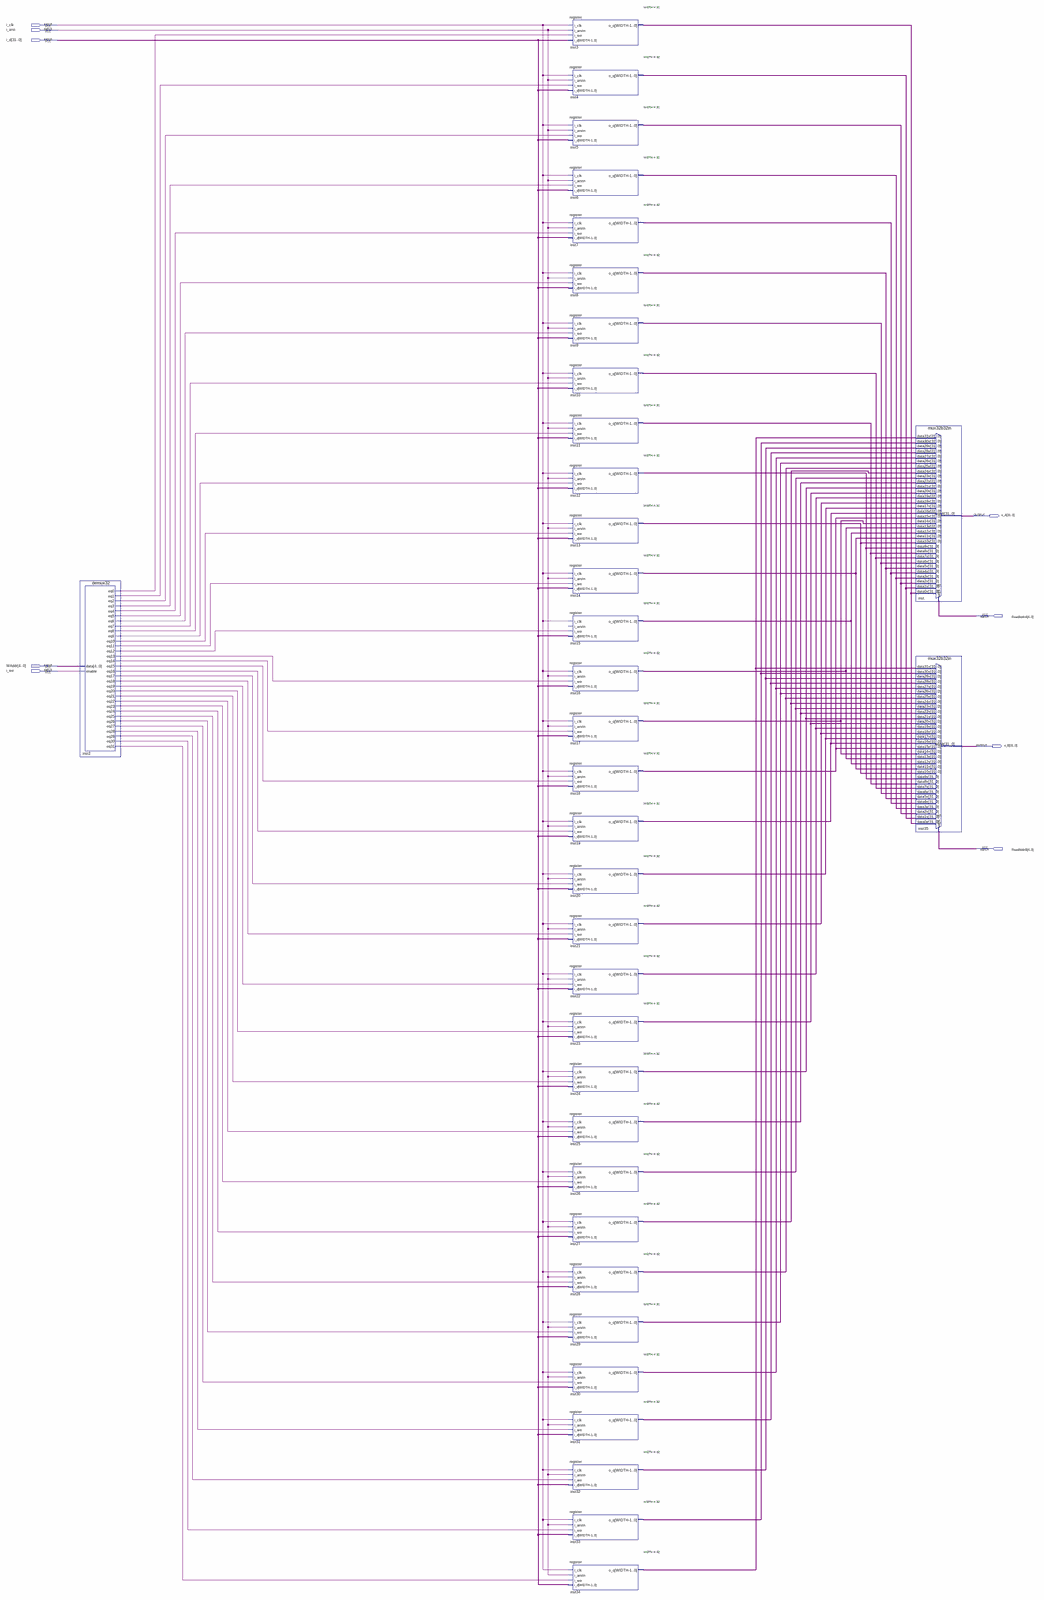
[diagram p0: schematic sheet, whole]
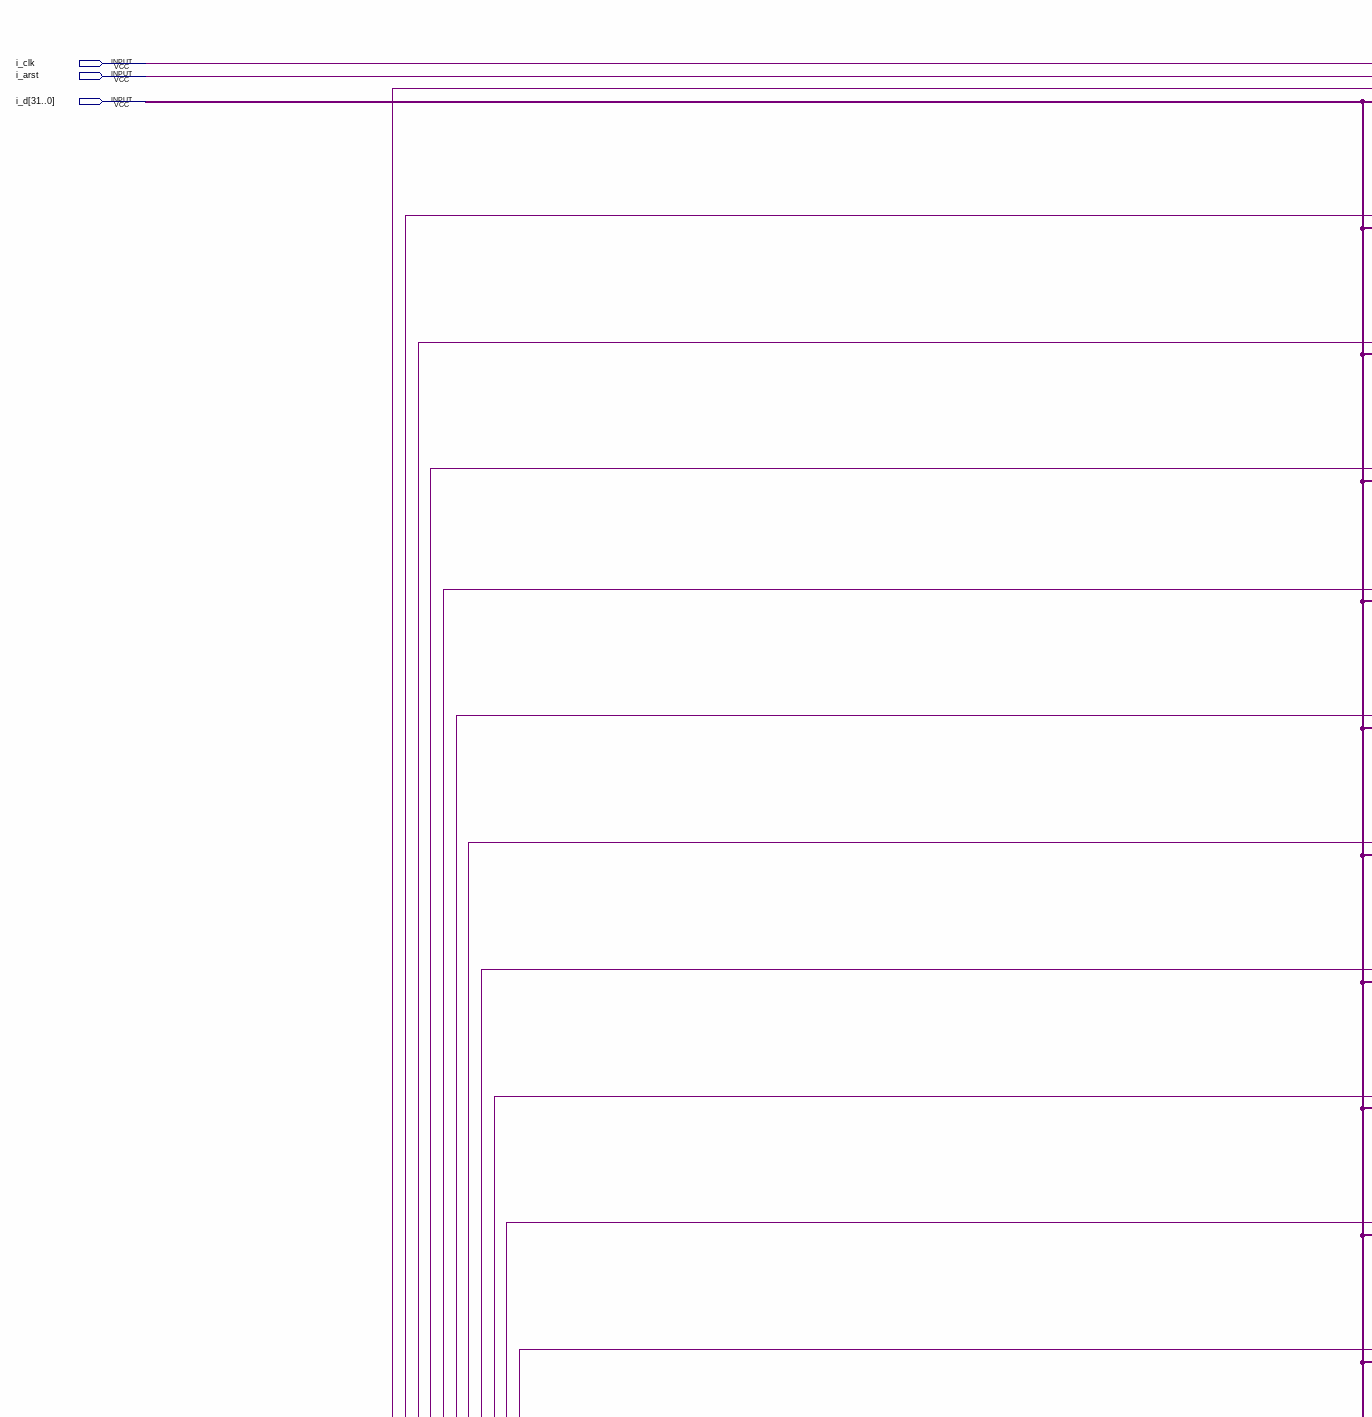
[diagram p1: schematic sheet, upper left part]
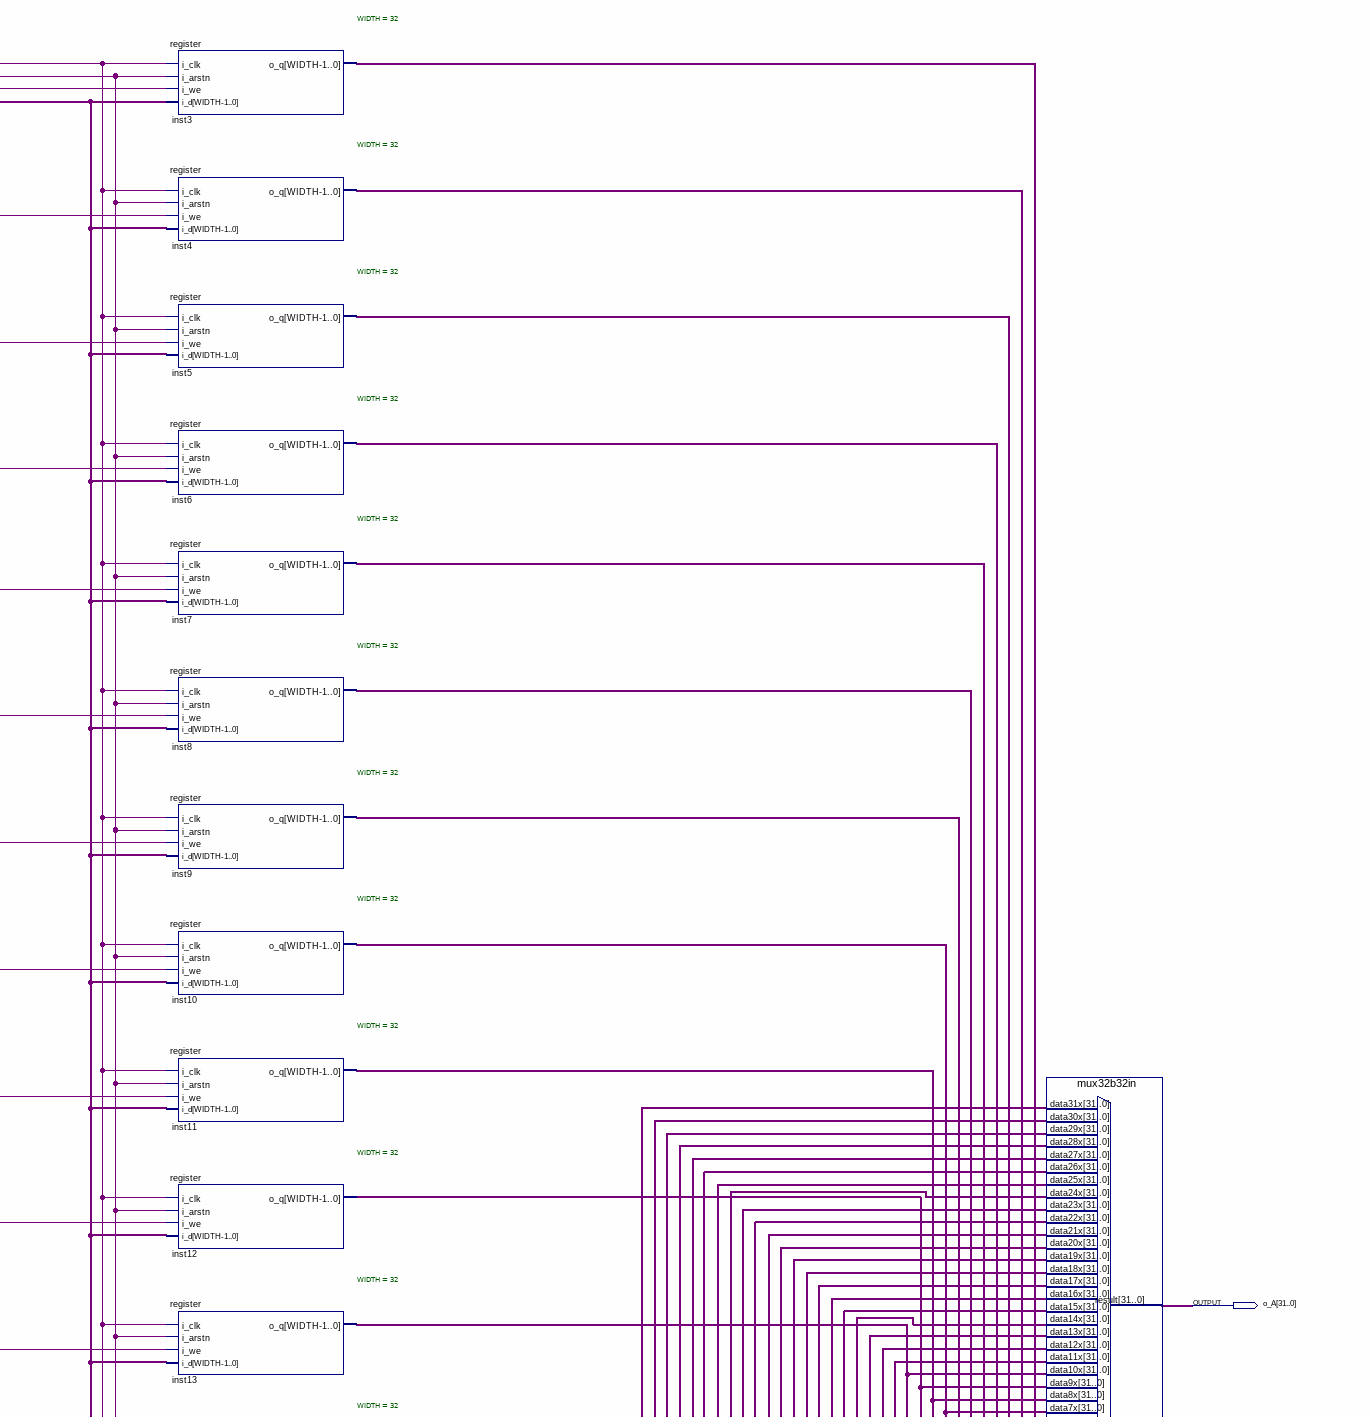
[diagram p2: schematic sheet, upper right part]
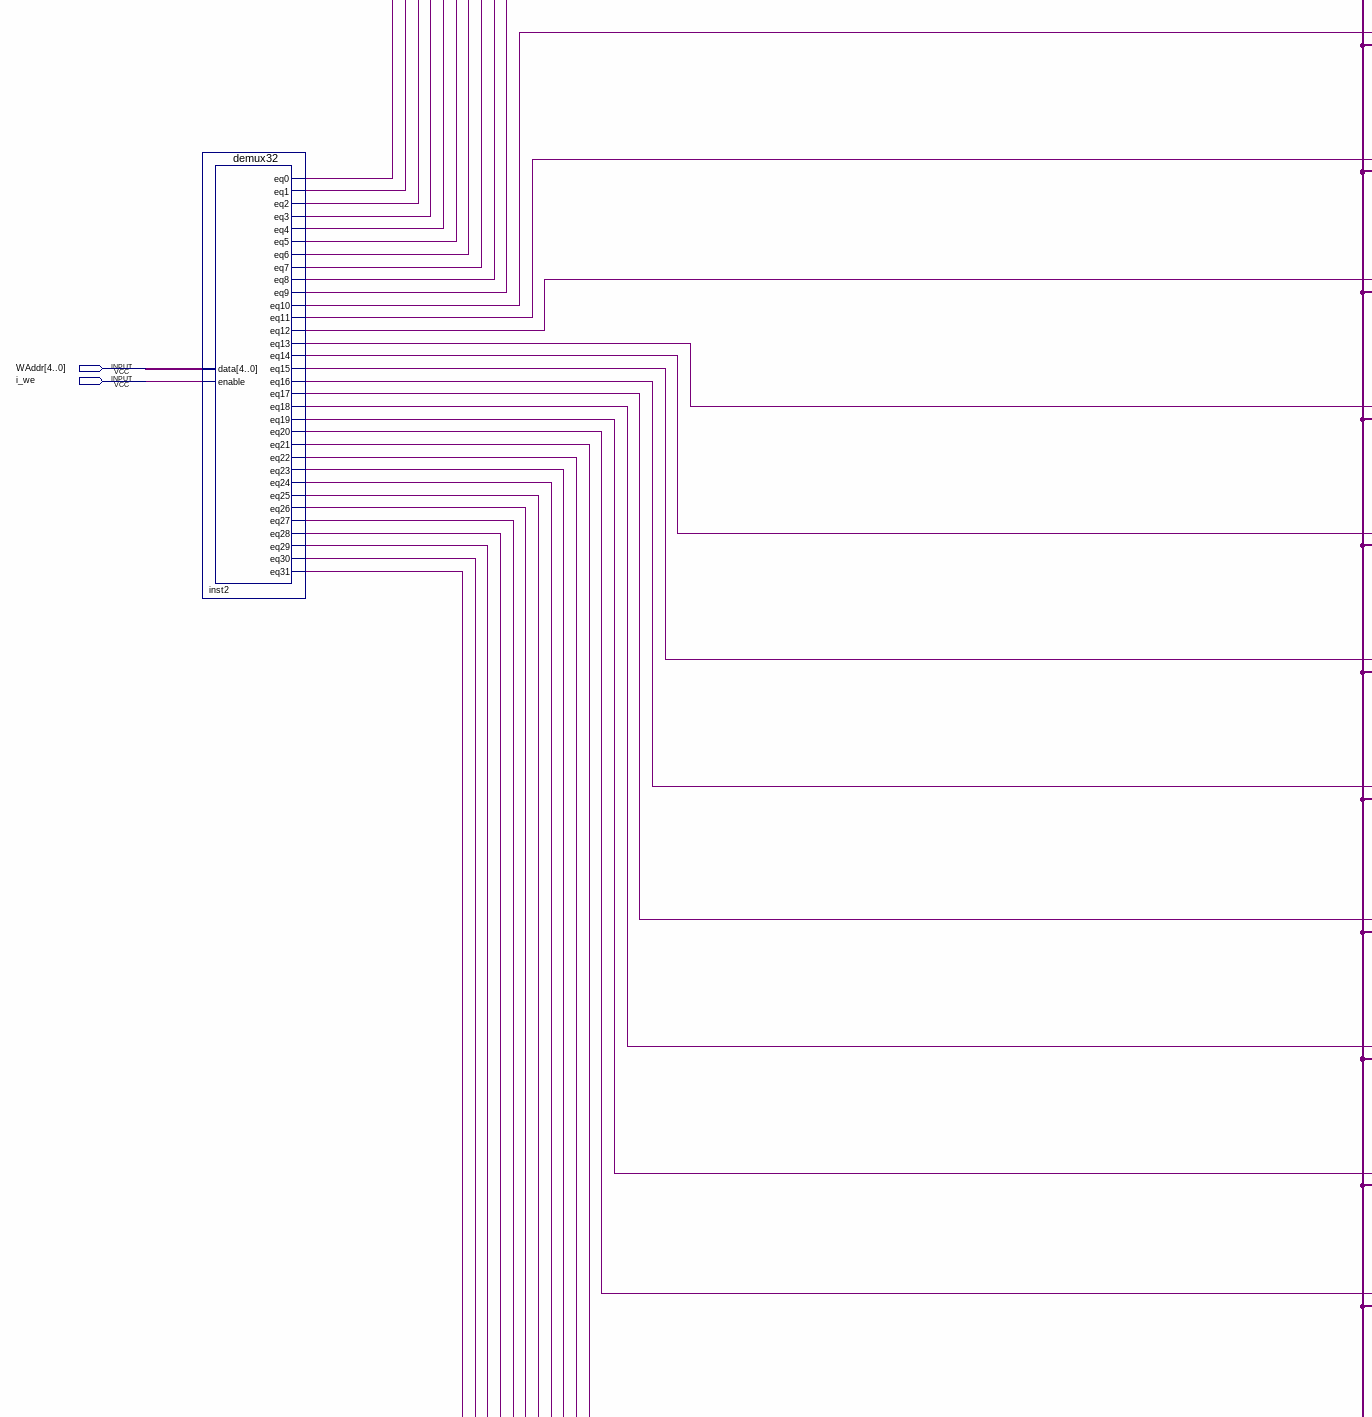
[diagram p3: schematic sheet, middle left part]
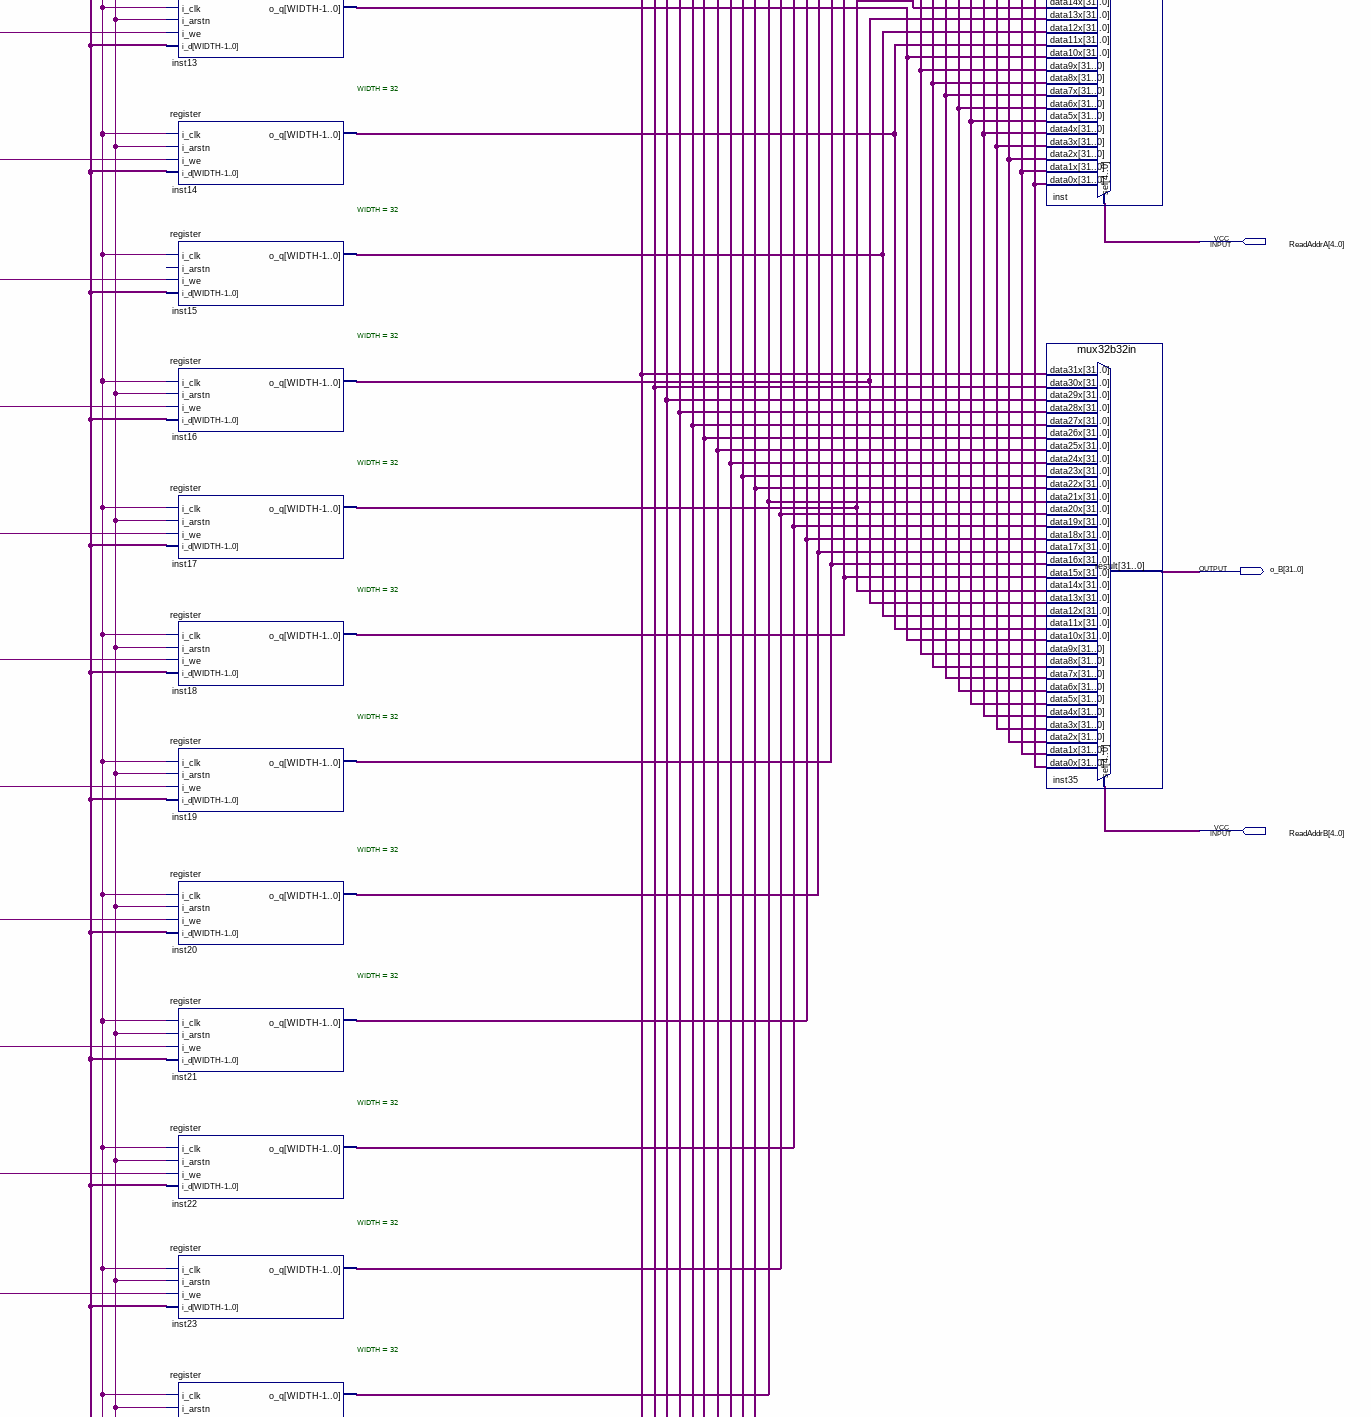
[diagram p4: schematic sheet, middle right part]
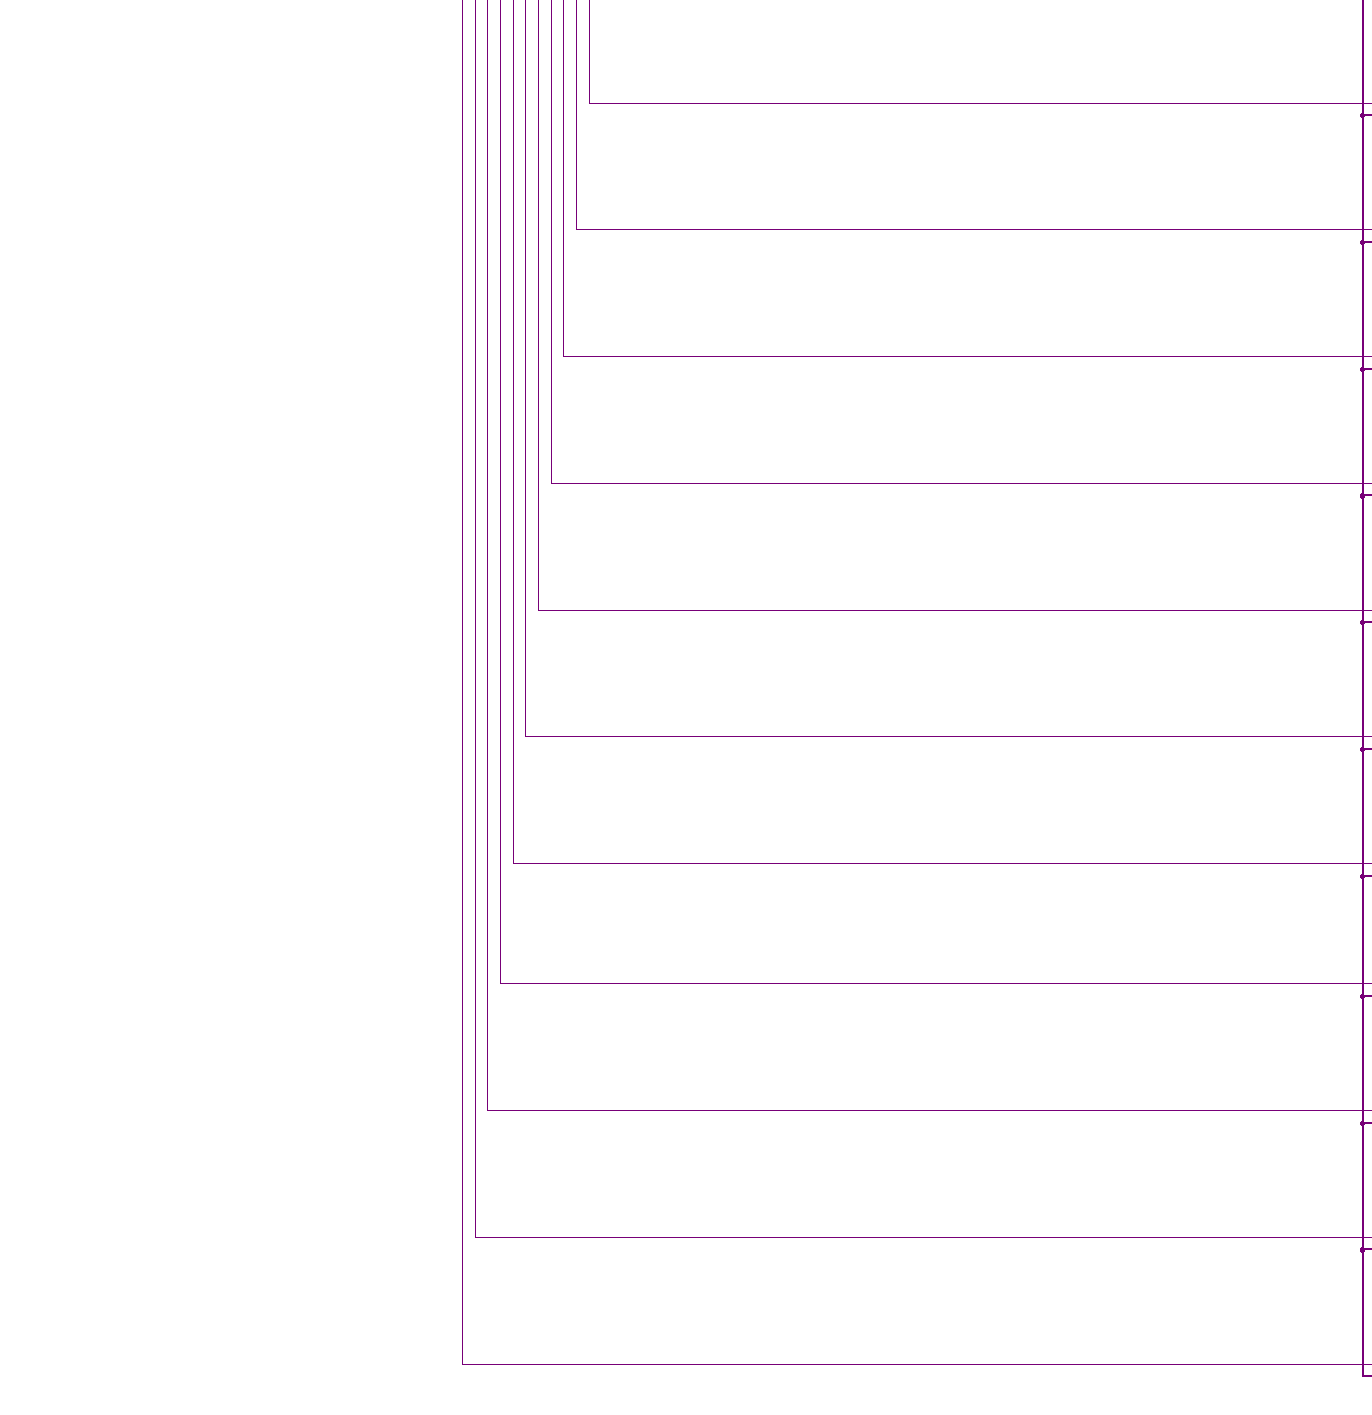
[diagram p5: schematic sheet, lower left part]
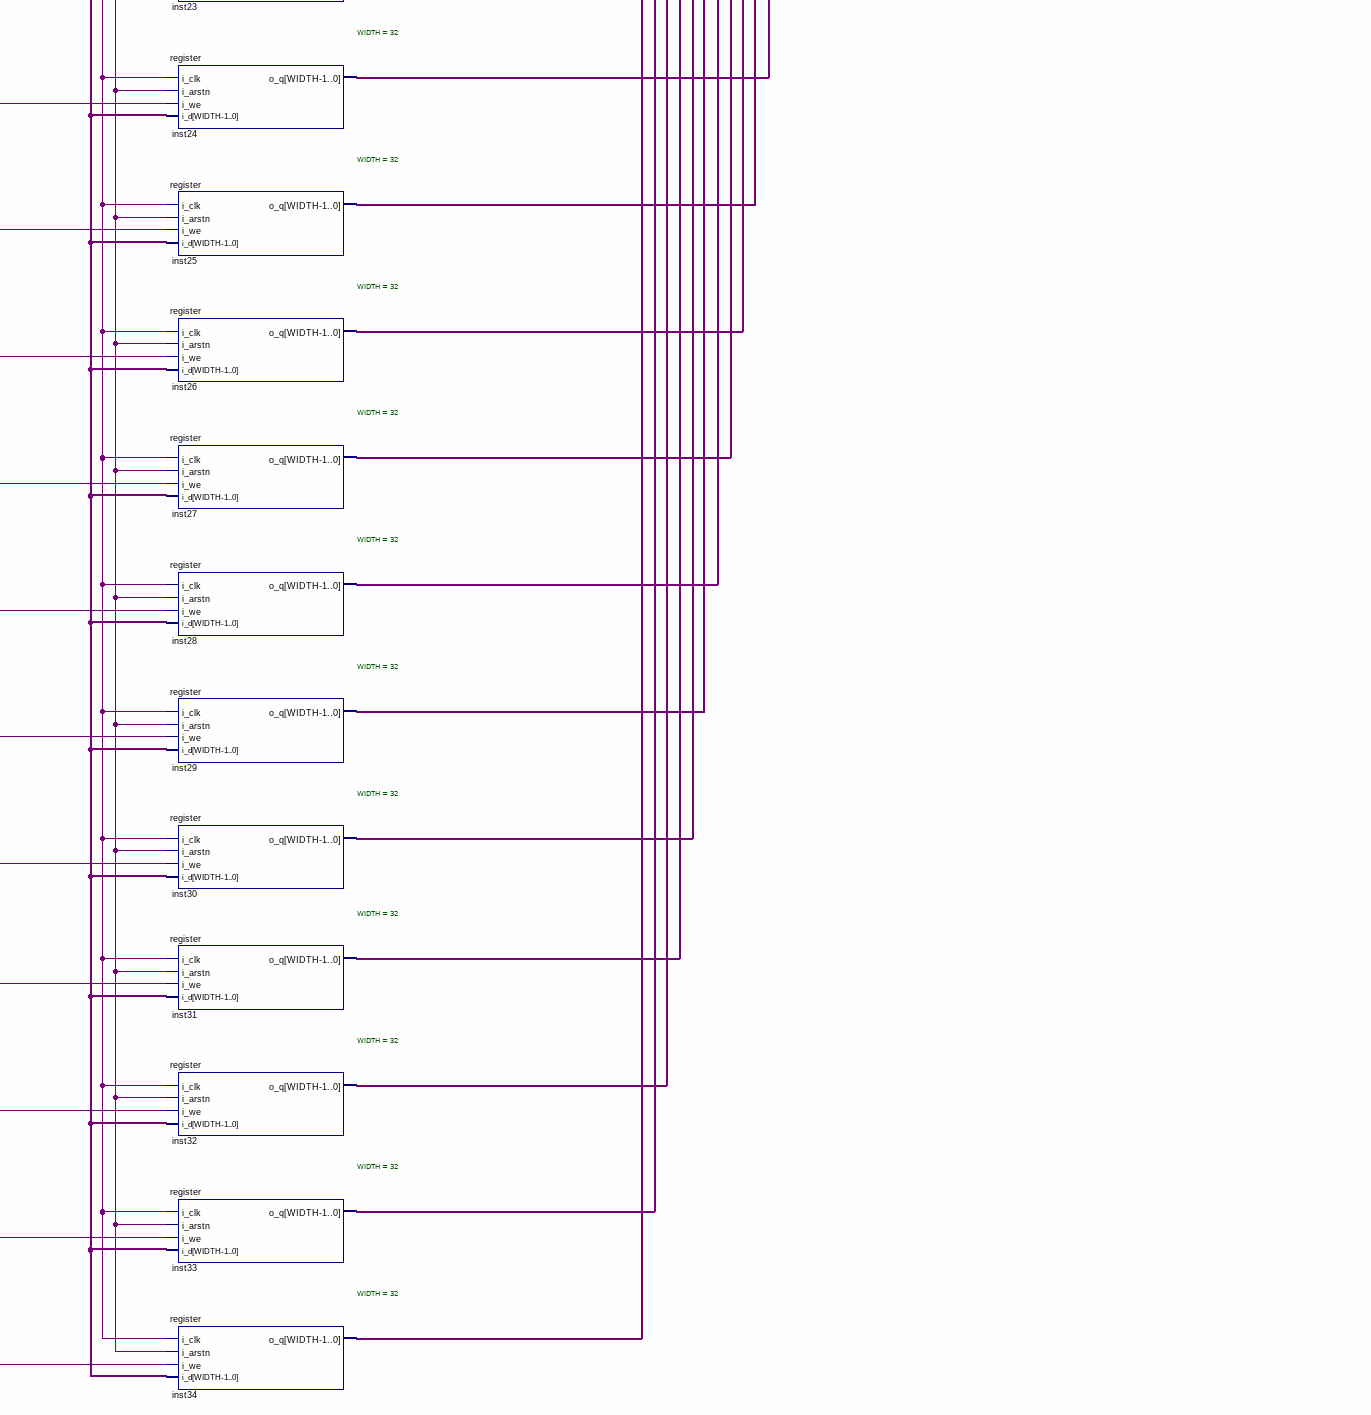
[diagram p6: schematic sheet, lower right part]
// Quartus schematic laba2.bdf as structural Verilog: 35 symbols, 9 pins
module laba2 (
  input  i_clk,
  input  i_arst,
  input  [31:0] i_d,
  input  [4:0] ReadAddrA,
  input  [4:0] WAddr,
  input  i_we,
  input  [4:0] ReadAddrB,
  output [31:0] o_A,
  output [31:0] o_B
);

  wire inst2_eq0, inst2_eq1, inst2_eq2, inst2_eq3, inst2_eq4, inst2_eq5, inst2_eq6, inst2_eq7, inst2_eq8,
       inst2_eq9, inst2_eq10, inst2_eq11, inst2_eq12, inst2_eq13, inst2_eq14, inst2_eq15, inst2_eq16,
       inst2_eq17, inst2_eq18, inst2_eq19, inst2_eq20, inst2_eq21, inst2_eq22, inst2_eq23, inst2_eq24,
       inst2_eq25, inst2_eq26, inst2_eq27, inst2_eq28, inst2_eq29, inst2_eq30, inst2_eq31;
  wire [31:0] inst3_o_q, inst4_o_q, inst5_o_q, inst6_o_q, inst7_o_q, inst8_o_q, inst9_o_q, inst10_o_q,
       inst11_o_q, inst12_o_q, inst13_o_q, inst14_o_q, inst15_o_q, inst16_o_q, inst17_o_q, inst18_o_q,
       inst19_o_q, inst20_o_q, inst21_o_q, inst22_o_q, inst23_o_q, inst24_o_q, inst25_o_q, inst26_o_q,
       inst27_o_q, inst28_o_q, inst29_o_q, inst30_o_q, inst31_o_q, inst32_o_q, inst33_o_q, inst34_o_q;

  demux32 inst2 (
    .data(WAddr), .enable(i_we), .eq0(inst2_eq0), .eq1(inst2_eq1), .eq2(inst2_eq2), .eq3(inst2_eq3),
    .eq4(inst2_eq4), .eq5(inst2_eq5), .eq6(inst2_eq6), .eq7(inst2_eq7), .eq8(inst2_eq8), .eq9(inst2_eq9),
    .eq10(inst2_eq10), .eq11(inst2_eq11), .eq12(inst2_eq12), .eq13(inst2_eq13), .eq14(inst2_eq14),
    .eq15(inst2_eq15), .eq16(inst2_eq16), .eq17(inst2_eq17), .eq18(inst2_eq18), .eq19(inst2_eq19),
    .eq20(inst2_eq20), .eq21(inst2_eq21), .eq22(inst2_eq22), .eq23(inst2_eq23), .eq24(inst2_eq24),
    .eq25(inst2_eq25), .eq26(inst2_eq26), .eq27(inst2_eq27), .eq28(inst2_eq28), .eq29(inst2_eq29),
    .eq30(inst2_eq30), .eq31(inst2_eq31));
  register #(.WIDTH(32)) inst3 (.i_clk(i_clk), .i_arstn(i_arst), .i_we(inst2_eq0), .i_d(i_d), .o_q(inst3_o_q));
  register #(.WIDTH(32)) inst4 (.i_clk(i_clk), .i_arstn(i_arst), .i_we(inst2_eq1), .i_d(i_d), .o_q(inst4_o_q));
  register #(.WIDTH(32)) inst5 (.i_clk(i_clk), .i_arstn(i_arst), .i_we(inst2_eq2), .i_d(i_d), .o_q(inst5_o_q));
  register #(.WIDTH(32)) inst6 (.i_clk(i_clk), .i_arstn(i_arst), .i_we(inst2_eq3), .i_d(i_d), .o_q(inst6_o_q));
  register #(.WIDTH(32)) inst7 (.i_clk(i_clk), .i_arstn(i_arst), .i_we(inst2_eq4), .i_d(i_d), .o_q(inst7_o_q));
  register #(.WIDTH(32)) inst8 (.i_clk(i_clk), .i_arstn(i_arst), .i_we(inst2_eq5), .i_d(i_d), .o_q(inst8_o_q));
  register #(.WIDTH(32)) inst9 (.i_clk(i_clk), .i_arstn(i_arst), .i_we(inst2_eq6), .i_d(i_d), .o_q(inst9_o_q));
  register #(.WIDTH(32)) inst10 (.i_clk(i_clk), .i_arstn(i_arst), .i_we(inst2_eq7), .i_d(i_d), .o_q(inst10_o_q));
  register #(.WIDTH(32)) inst11 (.i_clk(i_clk), .i_arstn(i_arst), .i_we(inst2_eq8), .i_d(i_d), .o_q(inst11_o_q));
  register #(.WIDTH(32)) inst12 (.i_clk(i_clk), .i_arstn(i_arst), .i_we(inst2_eq9), .i_d(i_d), .o_q(inst12_o_q));
  register #(.WIDTH(32)) inst13 (.i_clk(i_clk), .i_arstn(i_arst), .i_we(inst2_eq10), .i_d(i_d), .o_q(inst13_o_q));
  register #(.WIDTH(32)) inst14 (.i_clk(i_clk), .i_arstn(i_arst), .i_we(inst2_eq11), .i_d(i_d), .o_q(inst14_o_q));
  register #(.WIDTH(32)) inst15 (.i_clk(i_clk), .i_we(inst2_eq12), .i_d(i_d), .o_q(inst15_o_q));  // open: i_arstn
  register #(.WIDTH(32)) inst16 (.i_clk(i_clk), .i_arstn(i_arst), .i_we(inst2_eq13), .i_d(i_d), .o_q(inst16_o_q));
  register #(.WIDTH(32)) inst17 (.i_clk(i_clk), .i_arstn(i_arst), .i_we(inst2_eq14), .i_d(i_d), .o_q(inst17_o_q));
  register #(.WIDTH(32)) inst18 (.i_clk(i_clk), .i_arstn(i_arst), .i_we(inst2_eq15), .i_d(i_d), .o_q(inst18_o_q));
  register #(.WIDTH(32)) inst19 (.i_clk(i_clk), .i_arstn(i_arst), .i_we(inst2_eq16), .i_d(i_d), .o_q(inst19_o_q));
  register #(.WIDTH(32)) inst20 (.i_clk(i_clk), .i_arstn(i_arst), .i_we(inst2_eq17), .i_d(i_d), .o_q(inst20_o_q));
  register #(.WIDTH(32)) inst21 (.i_clk(i_clk), .i_arstn(i_arst), .i_we(inst2_eq18), .i_d(i_d), .o_q(inst21_o_q));
  register #(.WIDTH(32)) inst22 (.i_clk(i_clk), .i_arstn(i_arst), .i_we(inst2_eq19), .i_d(i_d), .o_q(inst22_o_q));
  register #(.WIDTH(32)) inst23 (.i_clk(i_clk), .i_arstn(i_arst), .i_we(inst2_eq20), .i_d(i_d), .o_q(inst23_o_q));
  register #(.WIDTH(32)) inst24 (.i_clk(i_clk), .i_arstn(i_arst), .i_we(inst2_eq21), .i_d(i_d), .o_q(inst24_o_q));
  register #(.WIDTH(32)) inst25 (.i_clk(i_clk), .i_arstn(i_arst), .i_we(inst2_eq22), .i_d(i_d), .o_q(inst25_o_q));
  register #(.WIDTH(32)) inst26 (.i_clk(i_clk), .i_arstn(i_arst), .i_we(inst2_eq23), .i_d(i_d), .o_q(inst26_o_q));
  register #(.WIDTH(32)) inst27 (.i_clk(i_clk), .i_arstn(i_arst), .i_we(inst2_eq24), .i_d(i_d), .o_q(inst27_o_q));
  register #(.WIDTH(32)) inst28 (.i_clk(i_clk), .i_arstn(i_arst), .i_we(inst2_eq25), .i_d(i_d), .o_q(inst28_o_q));
  register #(.WIDTH(32)) inst29 (.i_clk(i_clk), .i_arstn(i_arst), .i_we(inst2_eq26), .i_d(i_d), .o_q(inst29_o_q));
  register #(.WIDTH(32)) inst30 (.i_clk(i_clk), .i_arstn(i_arst), .i_we(inst2_eq27), .i_d(i_d), .o_q(inst30_o_q));
  register #(.WIDTH(32)) inst31 (.i_clk(i_clk), .i_arstn(i_arst), .i_we(inst2_eq28), .i_d(i_d), .o_q(inst31_o_q));
  register #(.WIDTH(32)) inst32 (.i_clk(i_clk), .i_arstn(i_arst), .i_we(inst2_eq29), .i_d(i_d), .o_q(inst32_o_q));
  register #(.WIDTH(32)) inst33 (.i_clk(i_clk), .i_arstn(i_arst), .i_we(inst2_eq30), .i_d(i_d), .o_q(inst33_o_q));
  register #(.WIDTH(32)) inst34 (.i_clk(i_clk), .i_arstn(i_arst), .i_we(inst2_eq31), .i_d(i_d), .o_q(inst34_o_q));
  mux32b32in inst (
    .data31x(inst34_o_q), .data30x(inst33_o_q), .data29x(inst32_o_q), .data28x(inst31_o_q),
    .data27x(inst30_o_q), .data26x(inst29_o_q), .data25x(inst28_o_q), .data24x(inst27_o_q),
    .data23x(inst26_o_q), .data22x(inst25_o_q), .data21x(inst24_o_q), .data20x(inst23_o_q),
    .data19x(inst22_o_q), .data18x(inst21_o_q), .data17x(inst20_o_q), .data16x(inst19_o_q),
    .data15x(inst18_o_q), .data14x(inst17_o_q), .data13x(inst16_o_q), .data12x(inst15_o_q),
    .data11x(inst14_o_q), .data10x(inst13_o_q), .data9x(inst12_o_q), .data8x(inst11_o_q),
    .data7x(inst10_o_q), .data6x(inst9_o_q), .data5x(inst8_o_q), .data4x(inst7_o_q), .data3x(inst6_o_q),
    .data2x(inst5_o_q), .data1x(inst4_o_q), .data0x(inst3_o_q), .sel(ReadAddrA), .result(o_A));
  mux32b32in inst35 (
    .data31x(inst34_o_q), .data30x(inst33_o_q), .data29x(inst32_o_q), .data28x(inst31_o_q),
    .data27x(inst30_o_q), .data26x(inst29_o_q), .data25x(inst28_o_q), .data24x(inst27_o_q),
    .data23x(inst26_o_q), .data22x(inst25_o_q), .data21x(inst24_o_q), .data20x(inst23_o_q),
    .data19x(inst22_o_q), .data18x(inst21_o_q), .data17x(inst20_o_q), .data16x(inst19_o_q),
    .data15x(inst18_o_q), .data14x(inst17_o_q), .data13x(inst16_o_q), .data12x(inst15_o_q),
    .data11x(inst14_o_q), .data10x(inst13_o_q), .data9x(inst12_o_q), .data8x(inst11_o_q),
    .data7x(inst10_o_q), .data6x(inst9_o_q), .data5x(inst8_o_q), .data4x(inst7_o_q), .data3x(inst6_o_q),
    .data2x(inst5_o_q), .data1x(inst4_o_q), .data0x(inst3_o_q), .sel(ReadAddrB), .result(o_B));
endmodule
